# Altium schematic sheet 3-Microcontroller.SchDoc
size 420 x 297 mm; CompanyName: Microchip Technology Inc.; Organization: Microchip Technology; Address1: 2355 West Chandler Blvd.; Address2: Chandler, AZ  85224; Address4: USA; SheetTitle: **; Time: Time
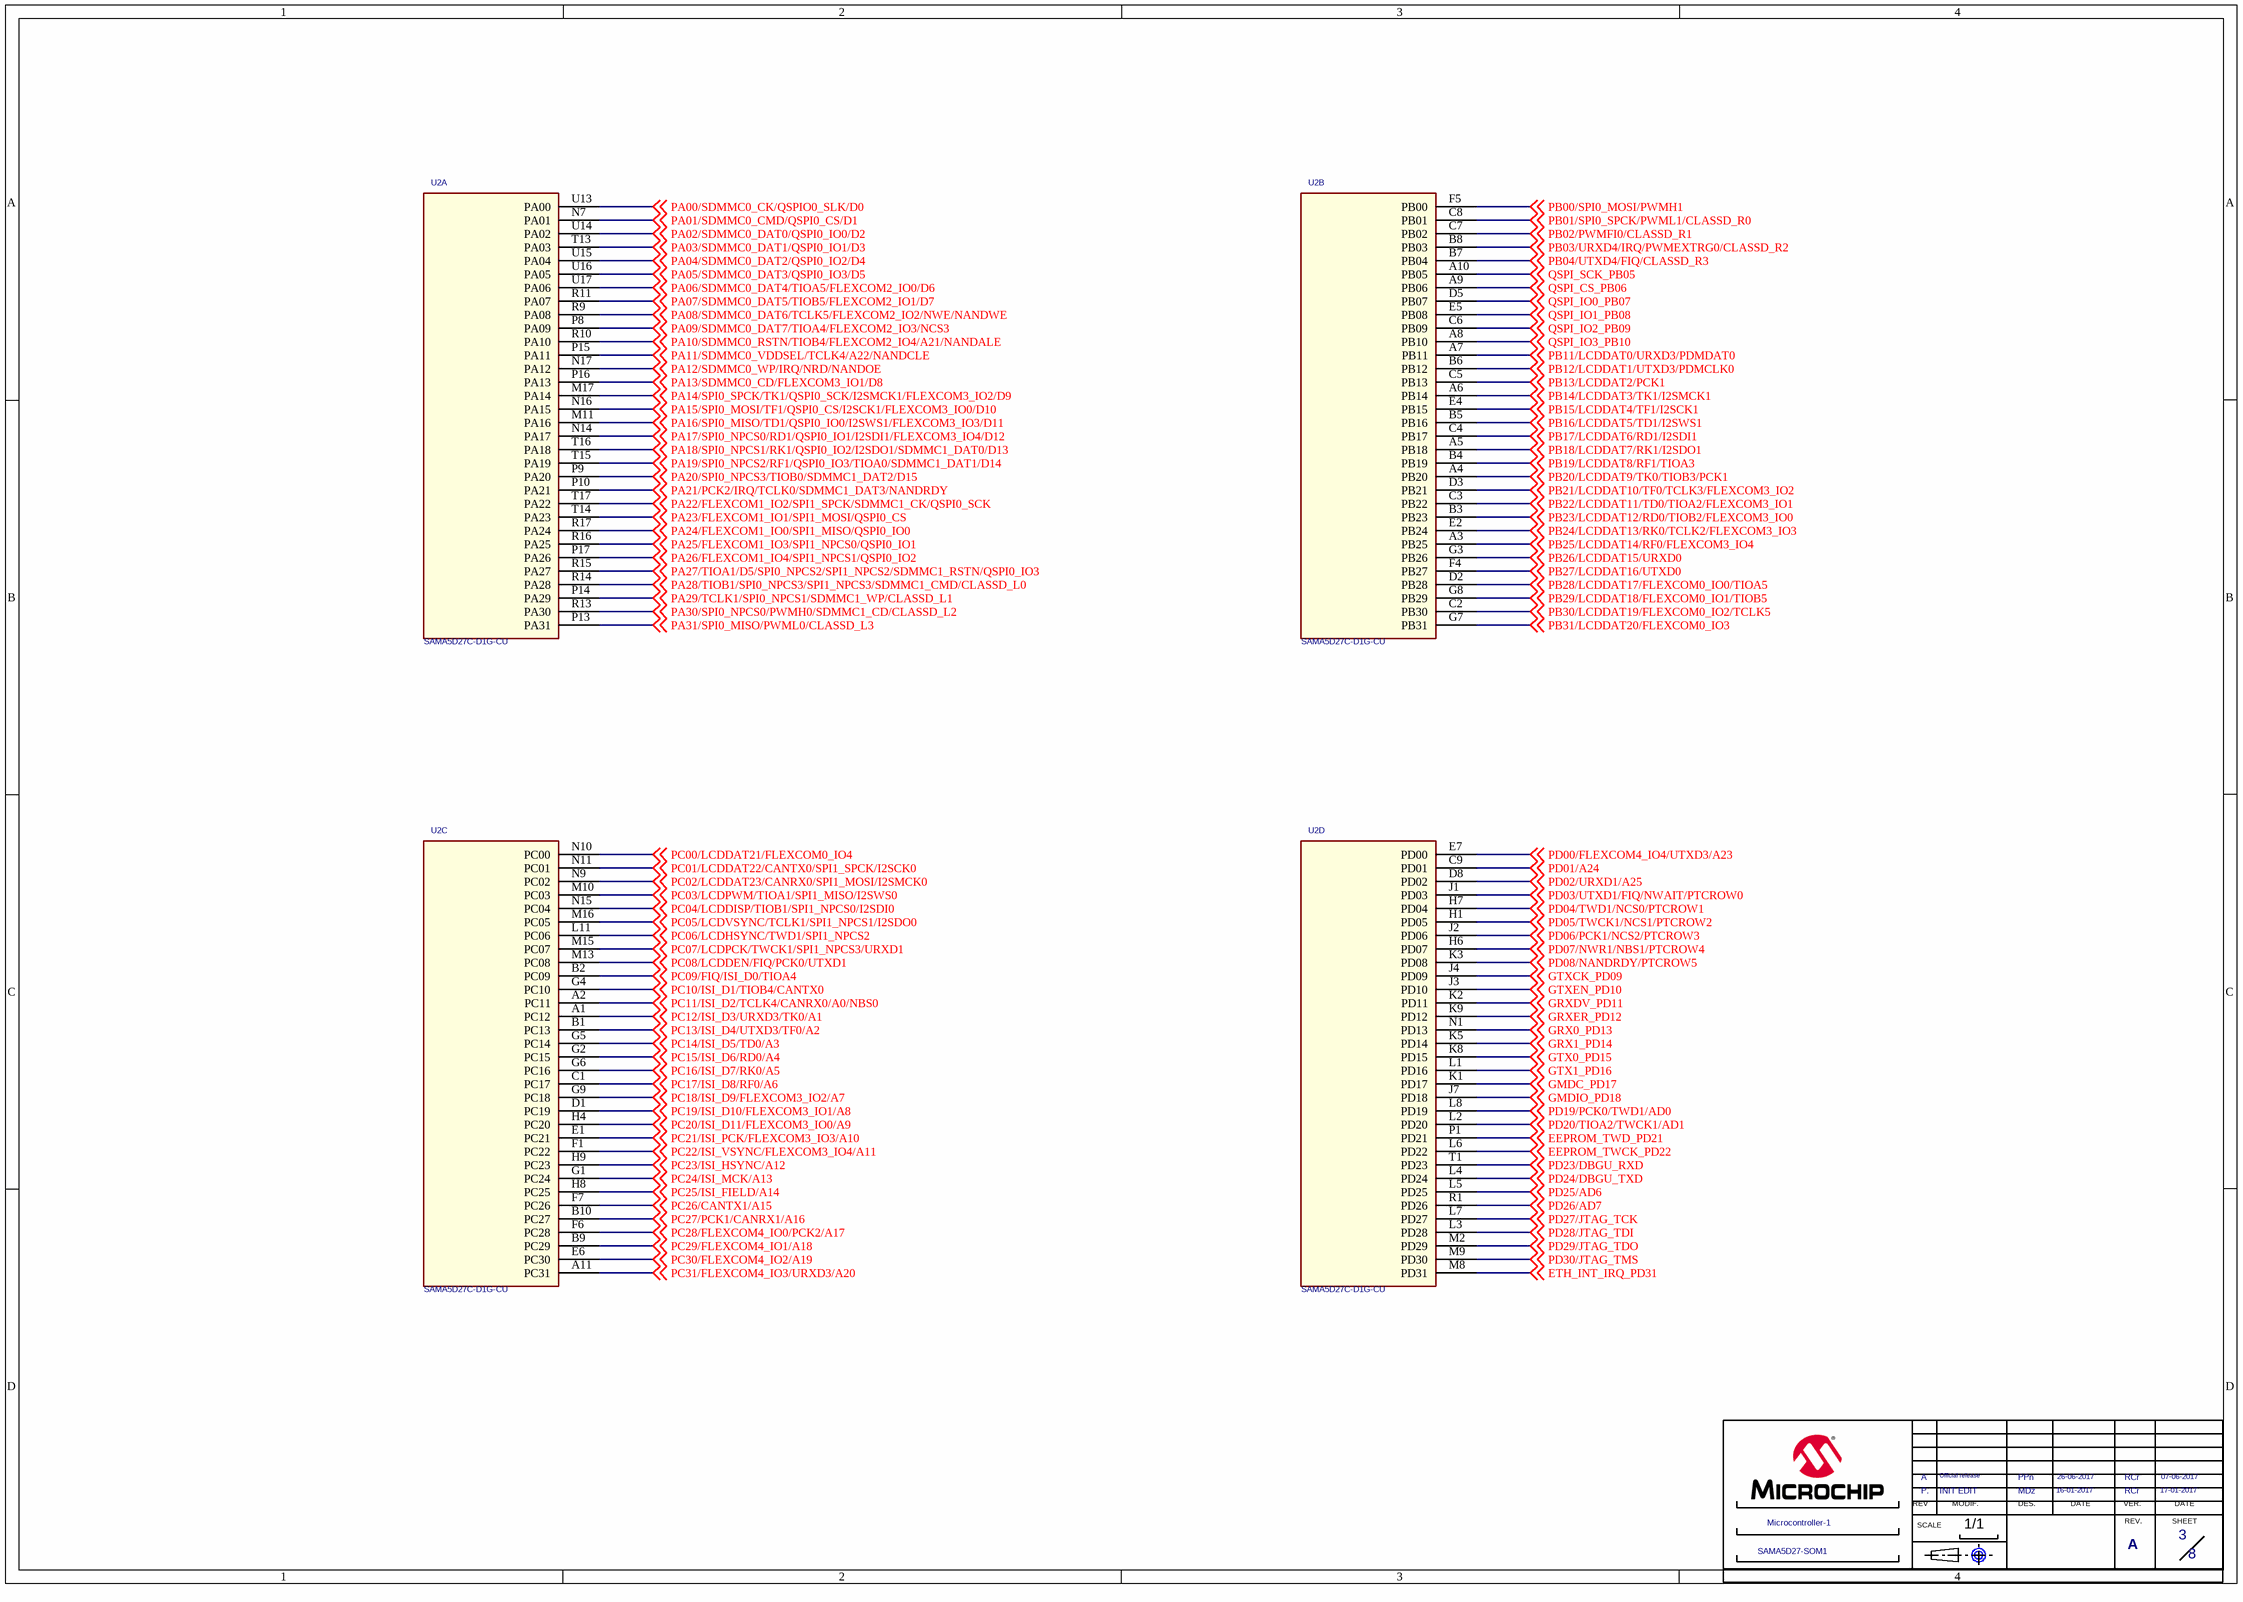
[diagram p0: 3-Microcontroller.SchDoc]

## Parts
*  MODIF.A: INIT EDIT  SHEET NAME 2: Microcontroller-1  SHEET NAME 1: SAMA5D27-SOM1  REV B: A  VERIF B: RCr  VERIF DATE A: 17-01-2017  VERIF DATE B: 07-06-2017  Page Count: 8  Page Number: 3  DATE A: 16-01-2017  DATE B: 26-06-2017  DES A: MDz  DES B: PPn  MODIF.B: Official release  REV A: P.  (hidden comment: CARTOUCHE MICROCHIP)  (graphical)
?  (no value)  (graphical)
U2  SAMA5D27C-D1G-CU  [BGA289_02]  (parts A,B,C,D of 7)

## Nets
EEPROM_TWCK_PD22: U2.L6(PD22) ; off-sheet EEPROM_TWCK_PD22
EEPROM_TWD_PD21: U2.P1(PD21) ; off-sheet EEPROM_TWD_PD21
ETH_INT_IRQ_PD31: U2.M8(PD31) ; off-sheet ETH_INT_IRQ_PD31
GMDC_PD17: U2.K1(PD17) ; off-sheet GMDC_PD17
GMDIO_PD18: U2.J7(PD18) ; off-sheet GMDIO_PD18
GRX0_PD13: U2.N1(PD13) ; off-sheet GRX0_PD13
GRX1_PD14: U2.K5(PD14) ; off-sheet GRX1_PD14
GRXDV_PD11: U2.K2(PD11) ; off-sheet GRXDV_PD11
GRXER_PD12: U2.K9(PD12) ; off-sheet GRXER_PD12
GTX0_PD15: U2.K8(PD15) ; off-sheet GTX0_PD15
GTX1_PD16: U2.L1(PD16) ; off-sheet GTX1_PD16
GTXCK_PD09: U2.J4(PD09) ; off-sheet GTXCK_PD09
GTXEN_PD10: U2.J3(PD10) ; off-sheet GTXEN_PD10
PA00/SDMMC0_CK/QSPIO0_SLK/D0: U2.U13(PA00) ; off-sheet PA00/SDMMC0_CK/QSPIO0_SLK/D0
PA01/SDMMC0_CMD/QSPI0_CS/D1: U2.N7(PA01) ; off-sheet PA01/SDMMC0_CMD/QSPI0_CS/D1
PA02/SDMMC0_DAT0/QSPI0_IO0/D2: U2.U14(PA02) ; off-sheet PA02/SDMMC0_DAT0/QSPI0_IO0/D2
PA03/SDMMC0_DAT1/QSPI0_IO1/D3: U2.T13(PA03) ; off-sheet PA03/SDMMC0_DAT1/QSPI0_IO1/D3
PA04/SDMMC0_DAT2/QSPI0_IO2/D4: U2.U15(PA04) ; off-sheet PA04/SDMMC0_DAT2/QSPI0_IO2/D4
PA05/SDMMC0_DAT3/QSPI0_IO3/D5: U2.U16(PA05) ; off-sheet PA05/SDMMC0_DAT3/QSPI0_IO3/D5
PA06/SDMMC0_DAT4/TIOA5/FLEXCOM2_IO0/D6: U2.U17(PA06) ; off-sheet PA06/SDMMC0_DAT4/TIOA5/FLEXCOM2_IO0/D6
PA07/SDMMC0_DAT5/TIOB5/FLEXCOM2_IO1/D7: U2.R11(PA07) ; off-sheet PA07/SDMMC0_DAT5/TIOB5/FLEXCOM2_IO1/D7
PA08/SDMMC0_DAT6/TCLK5/FLEXCOM2_IO2/NWE/NANDWE: U2.R9(PA08) ; off-sheet PA08/SDMMC0_DAT6/TCLK5/FLEXCOM2_IO2/NWE/NANDWE
PA09/SDMMC0_DAT7/TIOA4/FLEXCOM2_IO3/NCS3: U2.P8(PA09) ; off-sheet PA09/SDMMC0_DAT7/TIOA4/FLEXCOM2_IO3/NCS3
PA10/SDMMC0_RSTN/TIOB4/FLEXCOM2_IO4/A21/NANDALE: U2.R10(PA10) ; off-sheet PA10/SDMMC0_RSTN/TIOB4/FLEXCOM2_IO4/A21/NANDALE
PA11/SDMMC0_VDDSEL/TCLK4/A22/NANDCLE: U2.P15(PA11) ; off-sheet PA11/SDMMC0_VDDSEL/TCLK4/A22/NANDCLE
PA12/SDMMC0_WP/IRQ/NRD/NANDOE: U2.N17(PA12) ; off-sheet PA12/SDMMC0_WP/IRQ/NRD/NANDOE
PA13/SDMMC0_CD/FLEXCOM3_IO1/D8: U2.P16(PA13) ; off-sheet PA13/SDMMC0_CD/FLEXCOM3_IO1/D8
PA14/SPI0_SPCK/TK1/QSPI0_SCK/I2SMCK1/FLEXCOM3_IO2/D9: U2.M17(PA14) ; off-sheet PA14/SPI0_SPCK/TK1/QSPI0_SCK/I2SMCK1/FLEXCOM3_IO2/D9
PA15/SPI0_MOSI/TF1/QSPI0_CS/I2SCK1/FLEXCOM3_IO0/D10: U2.N16(PA15) ; off-sheet PA15/SPI0_MOSI/TF1/QSPI0_CS/I2SCK1/FLEXCOM3_IO0/D10
PA16/SPI0_MISO/TD1/QSPI0_IO0/I2SWS1/FLEXCOM3_IO3/D11: U2.M11(PA16) ; off-sheet PA16/SPI0_MISO/TD1/QSPI0_IO0/I2SWS1/FLEXCOM3_IO3/D11
PA17/SPI0_NPCS0/RD1/QSPI0_IO1/I2SDI1/FLEXCOM3_IO4/D12: U2.N14(PA17) ; off-sheet PA17/SPI0_NPCS0/RD1/QSPI0_IO1/I2SDI1/FLEXCOM3_IO4/D12
PA18/SPI0_NPCS1/RK1/QSPI0_IO2/I2SDO1/SDMMC1_DAT0/D13: U2.T16(PA18) ; off-sheet PA18/SPI0_NPCS1/RK1/QSPI0_IO2/I2SDO1/SDMMC1_DAT0/D13
PA19/SPI0_NPCS2/RF1/QSPI0_IO3/TIOA0/SDMMC1_DAT1/D14: U2.T15(PA19) ; off-sheet PA19/SPI0_NPCS2/RF1/QSPI0_IO3/TIOA0/SDMMC1_DAT1/D14
PA20/SPI0_NPCS3/TIOB0/SDMMC1_DAT2/D15: U2.P9(PA20) ; off-sheet PA20/SPI0_NPCS3/TIOB0/SDMMC1_DAT2/D15
PA21/PCK2/IRQ/TCLK0/SDMMC1_DAT3/NANDRDY: U2.P10(PA21) ; off-sheet PA21/PCK2/IRQ/TCLK0/SDMMC1_DAT3/NANDRDY
PA22/FLEXCOM1_IO2/SPI1_SPCK/SDMMC1_CK/QSPI0_SCK: U2.T17(PA22) ; off-sheet PA22/FLEXCOM1_IO2/SPI1_SPCK/SDMMC1_CK/QSPI0_SCK
PA23/FLEXCOM1_IO1/SPI1_MOSI/QSPI0_CS: U2.T14(PA23) ; off-sheet PA23/FLEXCOM1_IO1/SPI1_MOSI/QSPI0_CS
PA24/FLEXCOM1_IO0/SPI1_MISO/QSPI0_IO0: U2.R17(PA24) ; off-sheet PA24/FLEXCOM1_IO0/SPI1_MISO/QSPI0_IO0
PA25/FLEXCOM1_IO3/SPI1_NPCS0/QSPI0_IO1: U2.R16(PA25) ; off-sheet PA25/FLEXCOM1_IO3/SPI1_NPCS0/QSPI0_IO1
PA26/FLEXCOM1_IO4/SPI1_NPCS1/QSPI0_IO2: U2.P17(PA26) ; off-sheet PA26/FLEXCOM1_IO4/SPI1_NPCS1/QSPI0_IO2
PA27/TIOA1/D5/SPI0_NPCS2/SPI1_NPCS2/SDMMC1_RSTN/QSPI0_IO3: U2.R15(PA27) ; off-sheet PA27/TIOA1/D5/SPI0_NPCS2/SPI1_NPCS2/SDMMC1_RSTN/QSPI0_IO3
PA28/TIOB1/SPI0_NPCS3/SPI1_NPCS3/SDMMC1_CMD/CLASSD_L0: U2.R14(PA28) ; off-sheet PA28/TIOB1/SPI0_NPCS3/SPI1_NPCS3/SDMMC1_CMD/CLASSD_L0
PA29/TCLK1/SPI0_NPCS1/SDMMC1_WP/CLASSD_L1: U2.P14(PA29) ; off-sheet PA29/TCLK1/SPI0_NPCS1/SDMMC1_WP/CLASSD_L1
PA30/SPI0_NPCS0/PWMH0/SDMMC1_CD/CLASSD_L2: U2.R13(PA30) ; off-sheet PA30/SPI0_NPCS0/PWMH0/SDMMC1_CD/CLASSD_L2
PA31/SPI0_MISO/PWML0/CLASSD_L3: U2.P13(PA31) ; off-sheet PA31/SPI0_MISO/PWML0/CLASSD_L3
PB00/SPI0_MOSI/PWMH1: U2.F5(PB00) ; off-sheet PB00/SPI0_MOSI/PWMH1
PB01/SPI0_SPCK/PWML1/CLASSD_R0: U2.C8(PB01) ; off-sheet PB01/SPI0_SPCK/PWML1/CLASSD_R0
PB02/PWMFI0/CLASSD_R1: U2.C7(PB02) ; off-sheet PB02/PWMFI0/CLASSD_R1
PB03/URXD4/IRQ/PWMEXTRG0/CLASSD_R2: U2.B8(PB03) ; off-sheet PB03/URXD4/IRQ/PWMEXTRG0/CLASSD_R2
PB04/UTXD4/FIQ/CLASSD_R3: U2.B7(PB04) ; off-sheet PB04/UTXD4/FIQ/CLASSD_R3
PB11/LCDDAT0/URXD3/PDMDAT0: U2.A7(PB11) ; off-sheet PB11/LCDDAT0/URXD3/PDMDAT0
PB12/LCDDAT1/UTXD3/PDMCLK0: U2.B6(PB12) ; off-sheet PB12/LCDDAT1/UTXD3/PDMCLK0
PB13/LCDDAT2/PCK1: U2.C5(PB13) ; off-sheet PB13/LCDDAT2/PCK1
PB14/LCDDAT3/TK1/I2SMCK1: U2.A6(PB14) ; off-sheet PB14/LCDDAT3/TK1/I2SMCK1
PB15/LCDDAT4/TF1/I2SCK1: U2.E4(PB15) ; off-sheet PB15/LCDDAT4/TF1/I2SCK1
PB16/LCDDAT5/TD1/I2SWS1: U2.B5(PB16) ; off-sheet PB16/LCDDAT5/TD1/I2SWS1
PB17/LCDDAT6/RD1/I2SDI1: U2.C4(PB17) ; off-sheet PB17/LCDDAT6/RD1/I2SDI1
PB18/LCDDAT7/RK1/I2SDO1: U2.A5(PB18) ; off-sheet PB18/LCDDAT7/RK1/I2SDO1
PB19/LCDDAT8/RF1/TIOA3: U2.B4(PB19) ; off-sheet PB19/LCDDAT8/RF1/TIOA3
PB20/LCDDAT9/TK0/TIOB3/PCK1: U2.A4(PB20) ; off-sheet PB20/LCDDAT9/TK0/TIOB3/PCK1
PB21/LCDDAT10/TF0/TCLK3/FLEXCOM3_IO2: U2.D3(PB21) ; off-sheet PB21/LCDDAT10/TF0/TCLK3/FLEXCOM3_IO2
PB22/LCDDAT11/TD0/TIOA2/FLEXCOM3_IO1: U2.C3(PB22) ; off-sheet PB22/LCDDAT11/TD0/TIOA2/FLEXCOM3_IO1
PB23/LCDDAT12/RD0/TIOB2/FLEXCOM3_IO0: U2.B3(PB23) ; off-sheet PB23/LCDDAT12/RD0/TIOB2/FLEXCOM3_IO0
PB24/LCDDAT13/RK0/TCLK2/FLEXCOM3_IO3: U2.E2(PB24) ; off-sheet PB24/LCDDAT13/RK0/TCLK2/FLEXCOM3_IO3
PB25/LCDDAT14/RF0/FLEXCOM3_IO4: U2.A3(PB25) ; off-sheet PB25/LCDDAT14/RF0/FLEXCOM3_IO4
PB26/LCDDAT15/URXD0: U2.G3(PB26) ; off-sheet PB26/LCDDAT15/URXD0
PB27/LCDDAT16/UTXD0: U2.F4(PB27) ; off-sheet PB27/LCDDAT16/UTXD0
PB28/LCDDAT17/FLEXCOM0_IO0/TIOA5: U2.D2(PB28) ; off-sheet PB28/LCDDAT17/FLEXCOM0_IO0/TIOA5
PB29/LCDDAT18/FLEXCOM0_IO1/TIOB5: U2.G8(PB29) ; off-sheet PB29/LCDDAT18/FLEXCOM0_IO1/TIOB5
PB30/LCDDAT19/FLEXCOM0_IO2/TCLK5: U2.C2(PB30) ; off-sheet PB30/LCDDAT19/FLEXCOM0_IO2/TCLK5
PB31/LCDDAT20/FLEXCOM0_IO3: U2.G7(PB31) ; off-sheet PB31/LCDDAT20/FLEXCOM0_IO3
PC00/LCDDAT21/FLEXCOM0_IO4: U2.N10(PC00) ; off-sheet PC00/LCDDAT21/FLEXCOM0_IO4
PC01/LCDDAT22/CANTX0/SPI1_SPCK/I2SCK0: U2.N11(PC01) ; off-sheet PC01/LCDDAT22/CANTX0/SPI1_SPCK/I2SCK0
PC02/LCDDAT23/CANRX0/SPI1_MOSI/I2SMCK0: U2.N9(PC02) ; off-sheet PC02/LCDDAT23/CANRX0/SPI1_MOSI/I2SMCK0
PC03/LCDPWM/TIOA1/SPI1_MISO/I2SWS0: U2.M10(PC03) ; off-sheet PC03/LCDPWM/TIOA1/SPI1_MISO/I2SWS0
PC04/LCDDISP/TIOB1/SPI1_NPCS0/I2SDI0: U2.N15(PC04) ; off-sheet PC04/LCDDISP/TIOB1/SPI1_NPCS0/I2SDI0
PC05/LCDVSYNC/TCLK1/SPI1_NPCS1/I2SDO0: U2.M16(PC05) ; off-sheet PC05/LCDVSYNC/TCLK1/SPI1_NPCS1/I2SDO0
PC06/LCDHSYNC/TWD1/SPI1_NPCS2: U2.L11(PC06) ; off-sheet PC06/LCDHSYNC/TWD1/SPI1_NPCS2
PC07/LCDPCK/TWCK1/SPI1_NPCS3/URXD1: U2.M15(PC07) ; off-sheet PC07/LCDPCK/TWCK1/SPI1_NPCS3/URXD1
PC08/LCDDEN/FIQ/PCK0/UTXD1: U2.M13(PC08) ; off-sheet PC08/LCDDEN/FIQ/PCK0/UTXD1
PC09/FIQ/ISI_D0/TIOA4: U2.B2(PC09) ; off-sheet PC09/FIQ/ISI_D0/TIOA4
PC10/ISI_D1/TIOB4/CANTX0: U2.G4(PC10) ; off-sheet PC10/ISI_D1/TIOB4/CANTX0
PC11/ISI_D2/TCLK4/CANRX0/A0/NBS0: U2.A2(PC11) ; off-sheet PC11/ISI_D2/TCLK4/CANRX0/A0/NBS0
PC12/ISI_D3/URXD3/TK0/A1: U2.A1(PC12) ; off-sheet PC12/ISI_D3/URXD3/TK0/A1
PC13/ISI_D4/UTXD3/TF0/A2: U2.B1(PC13) ; off-sheet PC13/ISI_D4/UTXD3/TF0/A2
PC14/ISI_D5/TD0/A3: U2.G5(PC14) ; off-sheet PC14/ISI_D5/TD0/A3
PC15/ISI_D6/RD0/A4: U2.G2(PC15) ; off-sheet PC15/ISI_D6/RD0/A4
PC16/ISI_D7/RK0/A5: U2.G6(PC16) ; off-sheet PC16/ISI_D7/RK0/A5
PC17/ISI_D8/RF0/A6: U2.C1(PC17) ; off-sheet PC17/ISI_D8/RF0/A6
PC18/ISI_D9/FLEXCOM3_IO2/A7: U2.G9(PC18) ; off-sheet PC18/ISI_D9/FLEXCOM3_IO2/A7
PC19/ISI_D10/FLEXCOM3_IO1/A8: U2.D1(PC19) ; off-sheet PC19/ISI_D10/FLEXCOM3_IO1/A8
PC20/ISI_D11/FLEXCOM3_IO0/A9: U2.H4(PC20) ; off-sheet PC20/ISI_D11/FLEXCOM3_IO0/A9
PC21/ISI_PCK/FLEXCOM3_IO3/A10: U2.E1(PC21) ; off-sheet PC21/ISI_PCK/FLEXCOM3_IO3/A10
PC22/ISI_VSYNC/FLEXCOM3_IO4/A11: U2.F1(PC22) ; off-sheet PC22/ISI_VSYNC/FLEXCOM3_IO4/A11
PC23/ISI_HSYNC/A12: U2.H9(PC23) ; off-sheet PC23/ISI_HSYNC/A12
PC24/ISI_MCK/A13: U2.G1(PC24) ; off-sheet PC24/ISI_MCK/A13
PC25/ISI_FIELD/A14: U2.H8(PC25) ; off-sheet PC25/ISI_FIELD/A14
PC26/CANTX1/A15: U2.F7(PC26) ; off-sheet PC26/CANTX1/A15
PC27/PCK1/CANRX1/A16: U2.B10(PC27) ; off-sheet PC27/PCK1/CANRX1/A16
PC28/FLEXCOM4_IO0/PCK2/A17: U2.F6(PC28) ; off-sheet PC28/FLEXCOM4_IO0/PCK2/A17
PC29/FLEXCOM4_IO1/A18: U2.B9(PC29) ; off-sheet PC29/FLEXCOM4_IO1/A18
PC30/FLEXCOM4_IO2/A19: U2.E6(PC30) ; off-sheet PC30/FLEXCOM4_IO2/A19
PC31/FLEXCOM4_IO3/URXD3/A20: U2.A11(PC31) ; off-sheet PC31/FLEXCOM4_IO3/URXD3/A20
PD00/FLEXCOM4_IO4/UTXD3/A23: U2.E7(PD00) ; off-sheet PD00/FLEXCOM4_IO4/UTXD3/A23
PD01/A24: U2.C9(PD01) ; off-sheet PD01/A24
PD02/URXD1/A25: U2.D8(PD02) ; off-sheet PD02/URXD1/A25
PD03/UTXD1/FIQ/NWAIT/PTCROW0: U2.J1(PD03) ; off-sheet PD03/UTXD1/FIQ/NWAIT/PTCROW0
PD04/TWD1/NCS0/PTCROW1: U2.H7(PD04) ; off-sheet PD04/TWD1/NCS0/PTCROW1
PD05/TWCK1/NCS1/PTCROW2: U2.H1(PD05) ; off-sheet PD05/TWCK1/NCS1/PTCROW2
PD06/PCK1/NCS2/PTCROW3: U2.J2(PD06) ; off-sheet PD06/PCK1/NCS2/PTCROW3
PD07/NWR1/NBS1/PTCROW4: U2.H6(PD07) ; off-sheet PD07/NWR1/NBS1/PTCROW4
PD08/NANDRDY/PTCROW5: U2.K3(PD08) ; off-sheet PD08/NANDRDY/PTCROW5
PD19/PCK0/TWD1/AD0: U2.L8(PD19) ; off-sheet PD19/PCK0/TWD1/AD0
PD20/TIOA2/TWCK1/AD1: U2.L2(PD20) ; off-sheet PD20/TIOA2/TWCK1/AD1
PD23/DBGU_RXD: U2.T1(PD23) ; off-sheet PD23/DBGU_RXD
PD24/DBGU_TXD: U2.L4(PD24) ; off-sheet PD24/DBGU_TXD
PD25/AD6: U2.L5(PD25) ; off-sheet PD25/AD6
PD26/AD7: U2.R1(PD26) ; off-sheet PD26/AD7
PD27/JTAG_TCK: U2.L7(PD27) ; off-sheet PD27/JTAG_TCK
PD28/JTAG_TDI: U2.L3(PD28) ; off-sheet PD28/JTAG_TDI
PD29/JTAG_TDO: U2.M2(PD29) ; off-sheet PD29/JTAG_TDO
PD30/JTAG_TMS: U2.M9(PD30) ; off-sheet PD30/JTAG_TMS
QSPI_CS_PB06: U2.A9(PB06) ; off-sheet QSPI_CS_PB06
QSPI_IO0_PB07: U2.D5(PB07) ; off-sheet QSPI_IO0_PB07
QSPI_IO1_PB08: U2.E5(PB08) ; off-sheet QSPI_IO1_PB08
QSPI_IO2_PB09: U2.C6(PB09) ; off-sheet QSPI_IO2_PB09
QSPI_IO3_PB10: U2.A8(PB10) ; off-sheet QSPI_IO3_PB10
QSPI_SCK_PB05: U2.A10(PB05) ; off-sheet QSPI_SCK_PB05

## Notes on the sheet
- Drawn By:
- Engineer:
- PartNumber:
- Project Title
- Sheet Title
- Size
- B
- Revision:
- Sch #:
- Date:
- Sheet
- Designed with
- Altium.com <http://go.altium.com/MicrochipLandingPage_Evaluation.html>
- File:
- (in symbol CARTOUCHE MICROCHIP) REV; MODIF.; DES.; DATE; VER.; SCALE; REV.; SHEET; 1/1

## Library data of the parts
* = CARTOUCHE MICROCHIP: REV D: D; REV C: C; REV F: F; REV E: E; VERIF F: XXX; VERIF DATE F: XX-XXX-XX; MODIF.C: RevC; MODIF.D: RevD; MODIF.E: RevE; MODIF.F: RevF; VERIF E: XXX; VERIF D: XXX; VERIF C: RCr; VERIF A: RCr; VERIF DATE E: XX-XXX-XX; VERIF DATE D: XX-XXX-XX; VERIF DATE C: 07-06-2017; REV: A; FT: ?; Page Size: A; Page Create Date: june 19, 2004; DATE C: 07-06-2017; DATE D: XX-XXX-XX; DATE E: XX-XXX-XX; DATE F: XX-XXX-XX; DES E: XXX; DES F: XXX; DES C: XXX; DES D: XXX
? = Title Block B
U2 = SAMA5D27C-D1G-CU: DESIGNATION: SAMA5D27-SiP; FABRICANT: ATMEL; SPLIT_INST: TRUE; SWAP_INFO: (S1+S2+S3+S4+S5+S6+S7); TEMPERATURE: -40°C/+85°C